# EAGLE design W021J (EAGLE 9.5.2)
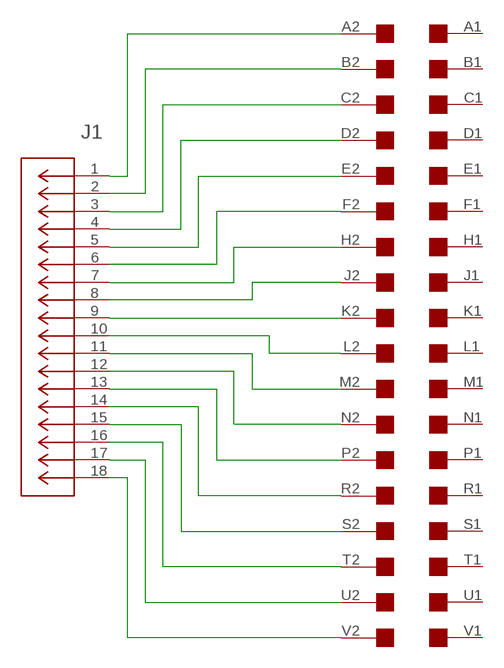
[diagram p0: schematic, sheet 1]

## Parts
EDGE1  EDGE-2CONNECTOR  [EDGE-CON2]
J1  503480-1800  [503480-1800]

## Nets
N$1: EDGE1.A2 J1.1
N$2: EDGE1.B2 J1.2
N$3: EDGE1.C2 J1.3
N$4: EDGE1.D2 J1.4
N$5: EDGE1.V2 J1.18
N$6: EDGE1.U2 J1.17
N$7: EDGE1.T2 J1.16
N$8: EDGE1.S2 J1.15
N$9: EDGE1.R2 J1.14
N$10: EDGE1.P2 J1.13
N$11: EDGE1.N2 J1.12
N$12: EDGE1.M2 J1.11
N$13: EDGE1.L2 J1.10
N$14: EDGE1.K2 J1.9
N$15: EDGE1.J2 J1.8
N$16: EDGE1.H2 J1.7
N$17: EDGE1.E2 J1.5
N$18: EDGE1.F2 J1.6
Unconnected: EDGE1.A1 EDGE1.B1 EDGE1.C1 EDGE1.D1 EDGE1.E1 EDGE1.F1 EDGE1.H1 EDGE1.J1 EDGE1.K1 EDGE1.L1 EDGE1.M1 EDGE1.N1 EDGE1.P1 EDGE1.R1 EDGE1.S1 EDGE1.T1 EDGE1.U1 EDGE1.V1

## Library data of the parts
EDGE1 = dec-con:EDGE-2: Double-Sided DEC edge connector.
J1 = MM24I:503480-1800: CONN FFC FPC 18POS 0.50MM R/A; BUILT_BY: EMA_UL_Team; MANUFACTURER_PART_NUMBER: 503480-0600; VENDOR: Molex Connector Corporation

## Net classes
0 default: width 0.3 mm, drill 0.3 mm

## Board
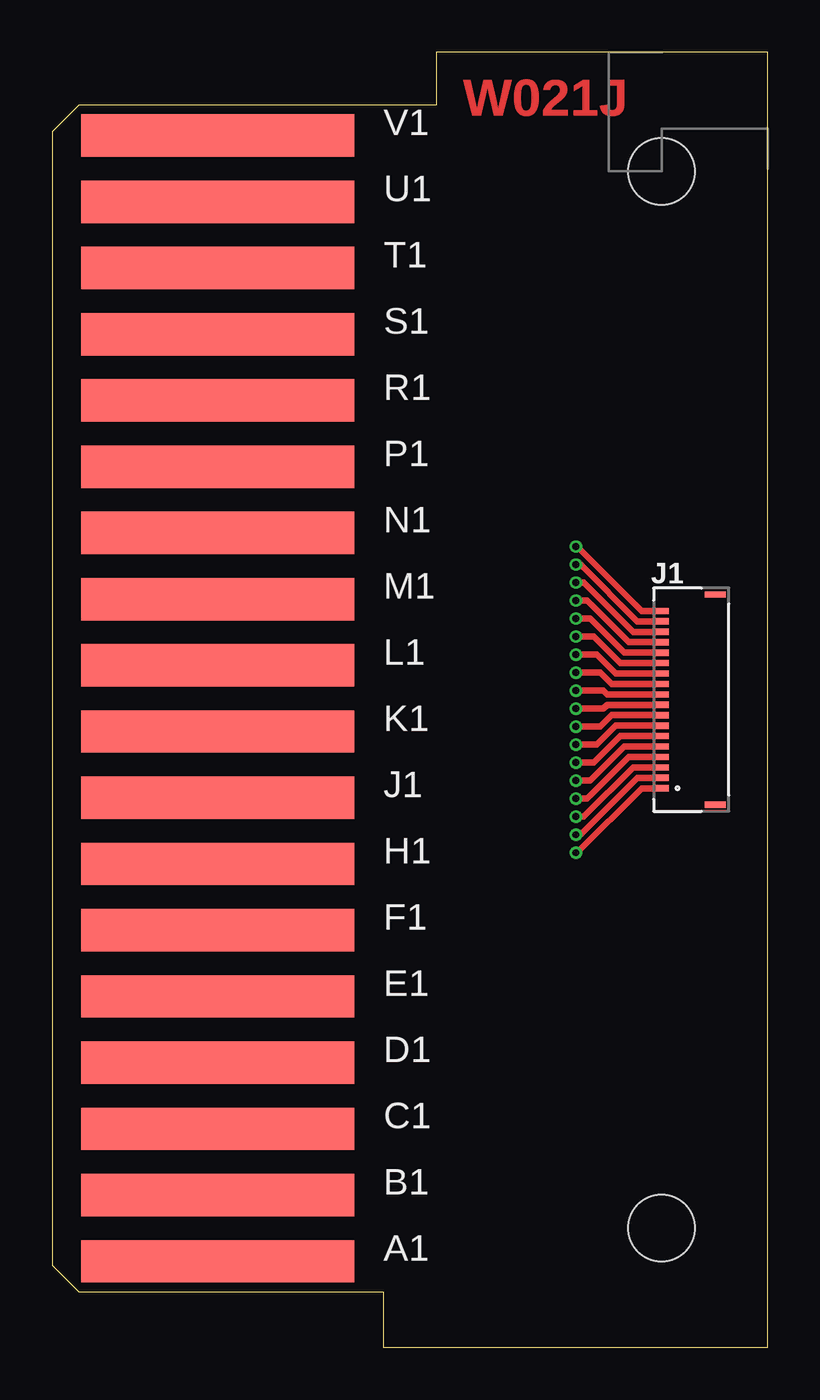
[diagram p1: board, top side]
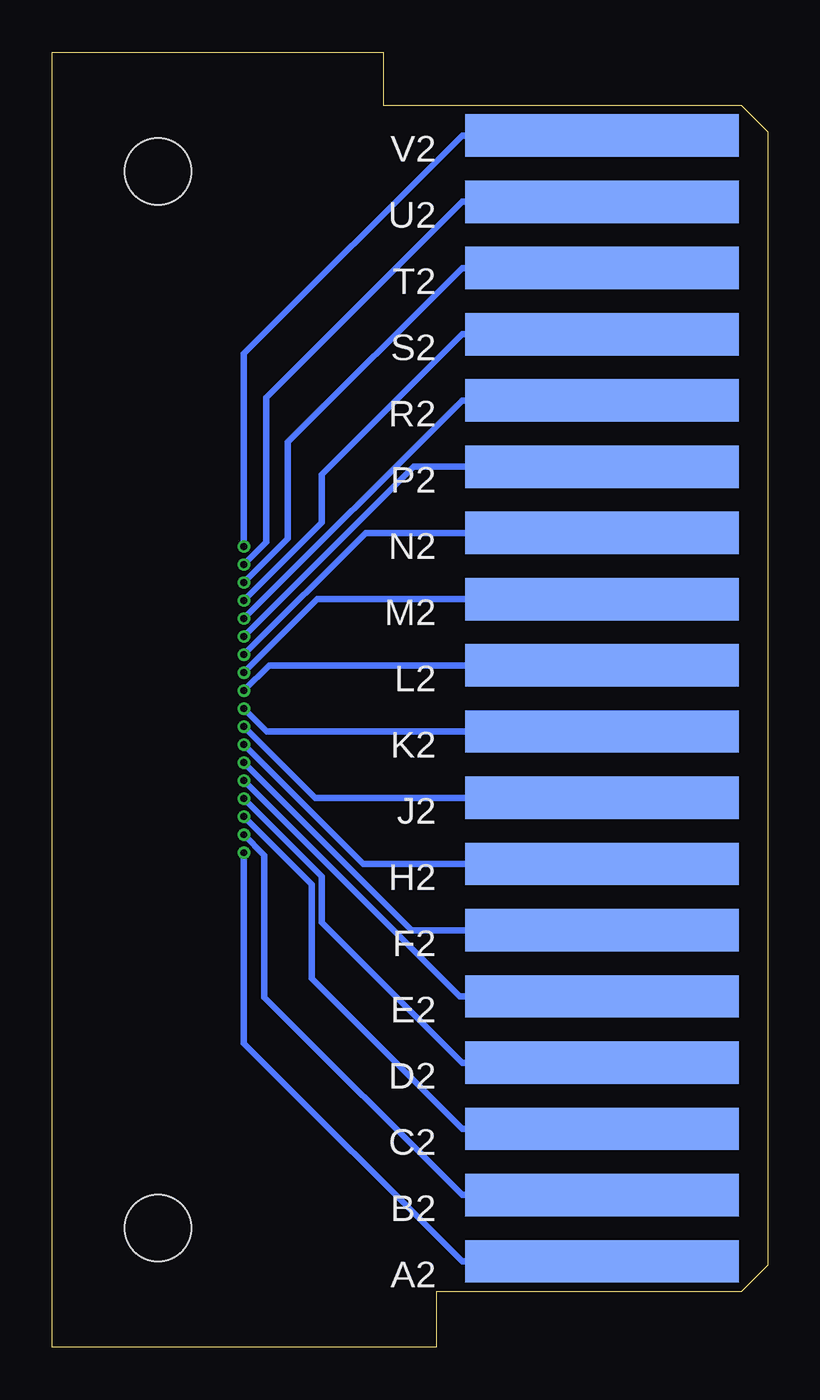
[diagram p2: board, bottom side, seen from below]

Size 34.29 x 62.1 mm. Coordinates in mm from the lower left corner, seen from the top.
Outline: 15.88,0 34.29,0 34.29,62.1 18.41,62.1
Copper layers (1*16): Top 0.035mm / dielectric 1.6mm / Bottom 0.035mm
Design rules "jlcpcb-2layers *": minimum track width 5mil, minimum drill 0.3mm, track to track 5mil, track to pad 5mil, pad to pad 5mil, via to via 5mil, smd to smd 5mil, copper to edge 0.2mm, drill to drill 6mil, minimum pad ring 10mil, minimum via ring 3mil, stop-mask expansion 4mil, vias tented up to drill 0mil, thermal gap 10mil
Holes 3.17 mm at 29.21,56.39 29.21,5.71

### Footprints (pad centres in the part's own frame; a part is rotated, then mirrored left to right if it is on the bottom)
EDGE-CON2 = smd 13.106 x 2.032: A1 7.938,4.128; B1 7.938,7.303; C1 7.938,10.477; D1 7.938,13.652; E1 7.938,16.828; F1 7.938,20.003; H1 7.938,23.177; J1 7.938,26.352; K1 7.938,29.527; L1 7.938,32.703; M1 7.938,35.877; N1 7.938,39.053; P1 7.938,42.227; R1 7.938,45.403; S1 7.938,48.578; T1 7.938,51.752; U1 7.938,54.928; V1 7.938,58.102 | smd 13.106 x 2.032 bottom: A2 7.938,4.128; B2 7.938,7.303; C2 7.938,10.477; D2 7.938,13.652; E2 7.938,16.828; F2 7.938,20.003; H2 7.938,23.177; J2 7.938,26.352; K2 7.938,29.527; L2 7.938,32.703; M2 7.938,35.877; N2 7.938,39.053; P2 7.938,42.227; R2 7.938,45.403; S2 7.938,48.578; T2 7.938,51.752; U2 7.938,54.928; V2 7.938,58.102
503480-1800 = smd 0.3 x 0.7: 1 0,0; 2 0.5,0; 3 1,0; 4 1.5,0; 5 2,0; 6 2.5,0; 7 3,0; 8 3.5,0; 9 4,0; 10 4.5,0; 11 5,0; 12 5.5,0; 13 6,0; 14 6.5,0; 15 7,0; 16 7.5,0; 17 8,0; 18 8.5,0 | smd 0.3 x 1: P$1 -0.79,-2.565; P$2 9.287,-2.565

### Placement (x,y rotation side)
EDGE1  0,0 0 top
J1  29.21,26.81 90 top

### Tracks (layer width: path | path; a pad name or v marks a point on that pad's centre or on a via)
N$1  (via drill 0.33)
  Top 0.3: J1.1 28.26,26.81 25.17,23.72 v25.1,23.72
  Bottom 0.3: EDGE1.A2 14.64,4.13 25.1,14.59 v25.1,23.72
N$2  (via drill 0.33)
  Top 0.3: J1.2 28.05,27.31 25.33,24.58 v25.1,24.58
  Bottom 0.3: EDGE1.B2 14.64,7.3 24.11,16.78 24.11,23.6 v25.1,24.58
N$3  (via drill 0.33)
  Top 0.3: J1.3 27.85,27.81 25.48,25.45 v25.1,25.45
  Bottom 0.3: EDGE1.C2 14.64,10.48 21.86,17.69 21.86,22.2 v25.1,25.45
N$4  (via drill 0.33)
  Top 0.3: J1.4 27.64,28.31 25.64,26.31 v25.1,26.31
  Bottom 0.3: EDGE1.D2 14.64,13.65 21.37,20.38 21.37,22.58 v25.1,26.31
N$5  (via drill 0.33)
  Top 0.3: J1.18 28.26,35.31 25.17,38.4 v25.1,38.4
  Bottom 0.3: EDGE1.V2 14.64,58.1 25.1,47.64 v25.1,38.4
N$6  (via drill 0.33)
  Top 0.3: J1.17 28.05,34.81 25.33,37.53 v25.1,37.53
  Bottom 0.3: EDGE1.U2 14.64,54.93 24.02,45.55 24.02,38.61 v25.1,37.53
N$7  (via drill 0.33)
  Top 0.3: J1.16 27.85,34.31 25.48,36.67 v25.1,36.67
  Bottom 0.3: EDGE1.T2 14.64,51.75 23,43.4 23,38.77 v25.1,36.67
N$8  (via drill 0.33)
  Top 0.3: J1.15 27.64,33.81 25.64,35.81 v25.1,35.81
  Bottom 0.3: EDGE1.S2 14.64,48.58 21.37,41.85 21.37,39.54 v25.1,35.81
N$9  (via drill 0.33)
  Top 0.3: J1.14 27.43,33.31 25.8,34.94 v25.1,34.94
  Bottom 0.3: EDGE1.R2 14.64,45.4 v25.1,34.94
N$10  (via drill 0.33)
  Top 0.3: J1.13 27.22,32.81 25.95,34.08 v25.1,34.08
  Bottom 0.3: EDGE1.P2 16.95,42.23 v25.1,34.08
N$11  (via drill 0.33)
  Top 0.3: J1.12 27.02,32.31 26.11,33.22 v25.1,33.22
  Bottom 0.3: EDGE1.N2 19.27,39.05 v25.1,33.22
N$12  (via drill 0.33)
  Top 0.3: J1.11 26.81,31.81 26.27,32.35 v25.1,32.35
  Bottom 0.3: EDGE1.M2 21.58,35.88 v25.1,32.35
N$13  (via drill 0.33)
  Top 0.3: J1.10 26.6,31.31 26.42,31.49 v25.1,31.49
  Bottom 0.3: EDGE1.L2 23.89,32.7 v25.1,31.49
N$14  (via drill 0.33)
  Top 0.3: J1.9 26.6,30.81 26.42,30.63 v25.1,30.63
  Bottom 0.3: EDGE1.K2 24,29.53 v25.1,30.63
N$15  (via drill 0.33)
  Top 0.3: J1.8 26.81,30.31 26.27,29.76 v25.1,29.76
  Bottom 0.3: EDGE1.J2 21.69,26.35 v25.1,29.76
N$16  (via drill 0.33)
  Top 0.3: J1.7 27.02,29.81 26.11,28.9 v25.1,28.9
  Bottom 0.3: EDGE1.H2 19.38,23.18 v25.1,28.9
N$17  (via drill 0.33)
  Top 0.3: J1.5 27.43,28.81 25.8,27.17 v25.1,27.17
  Bottom 0.3: EDGE1.E2 14.75,16.83 v25.1,27.17
N$18  (via drill 0.33)
  Top 0.3: J1.6 27.22,29.31 25.95,28.04 v25.1,28.04
  Bottom 0.3: EDGE1.F2 17.07,20 v25.1,28.04

### Text on the board
Top: W021J | W021J
tStop: W021J